# Altium schematic sheet LOGIC.SchDoc
size A3
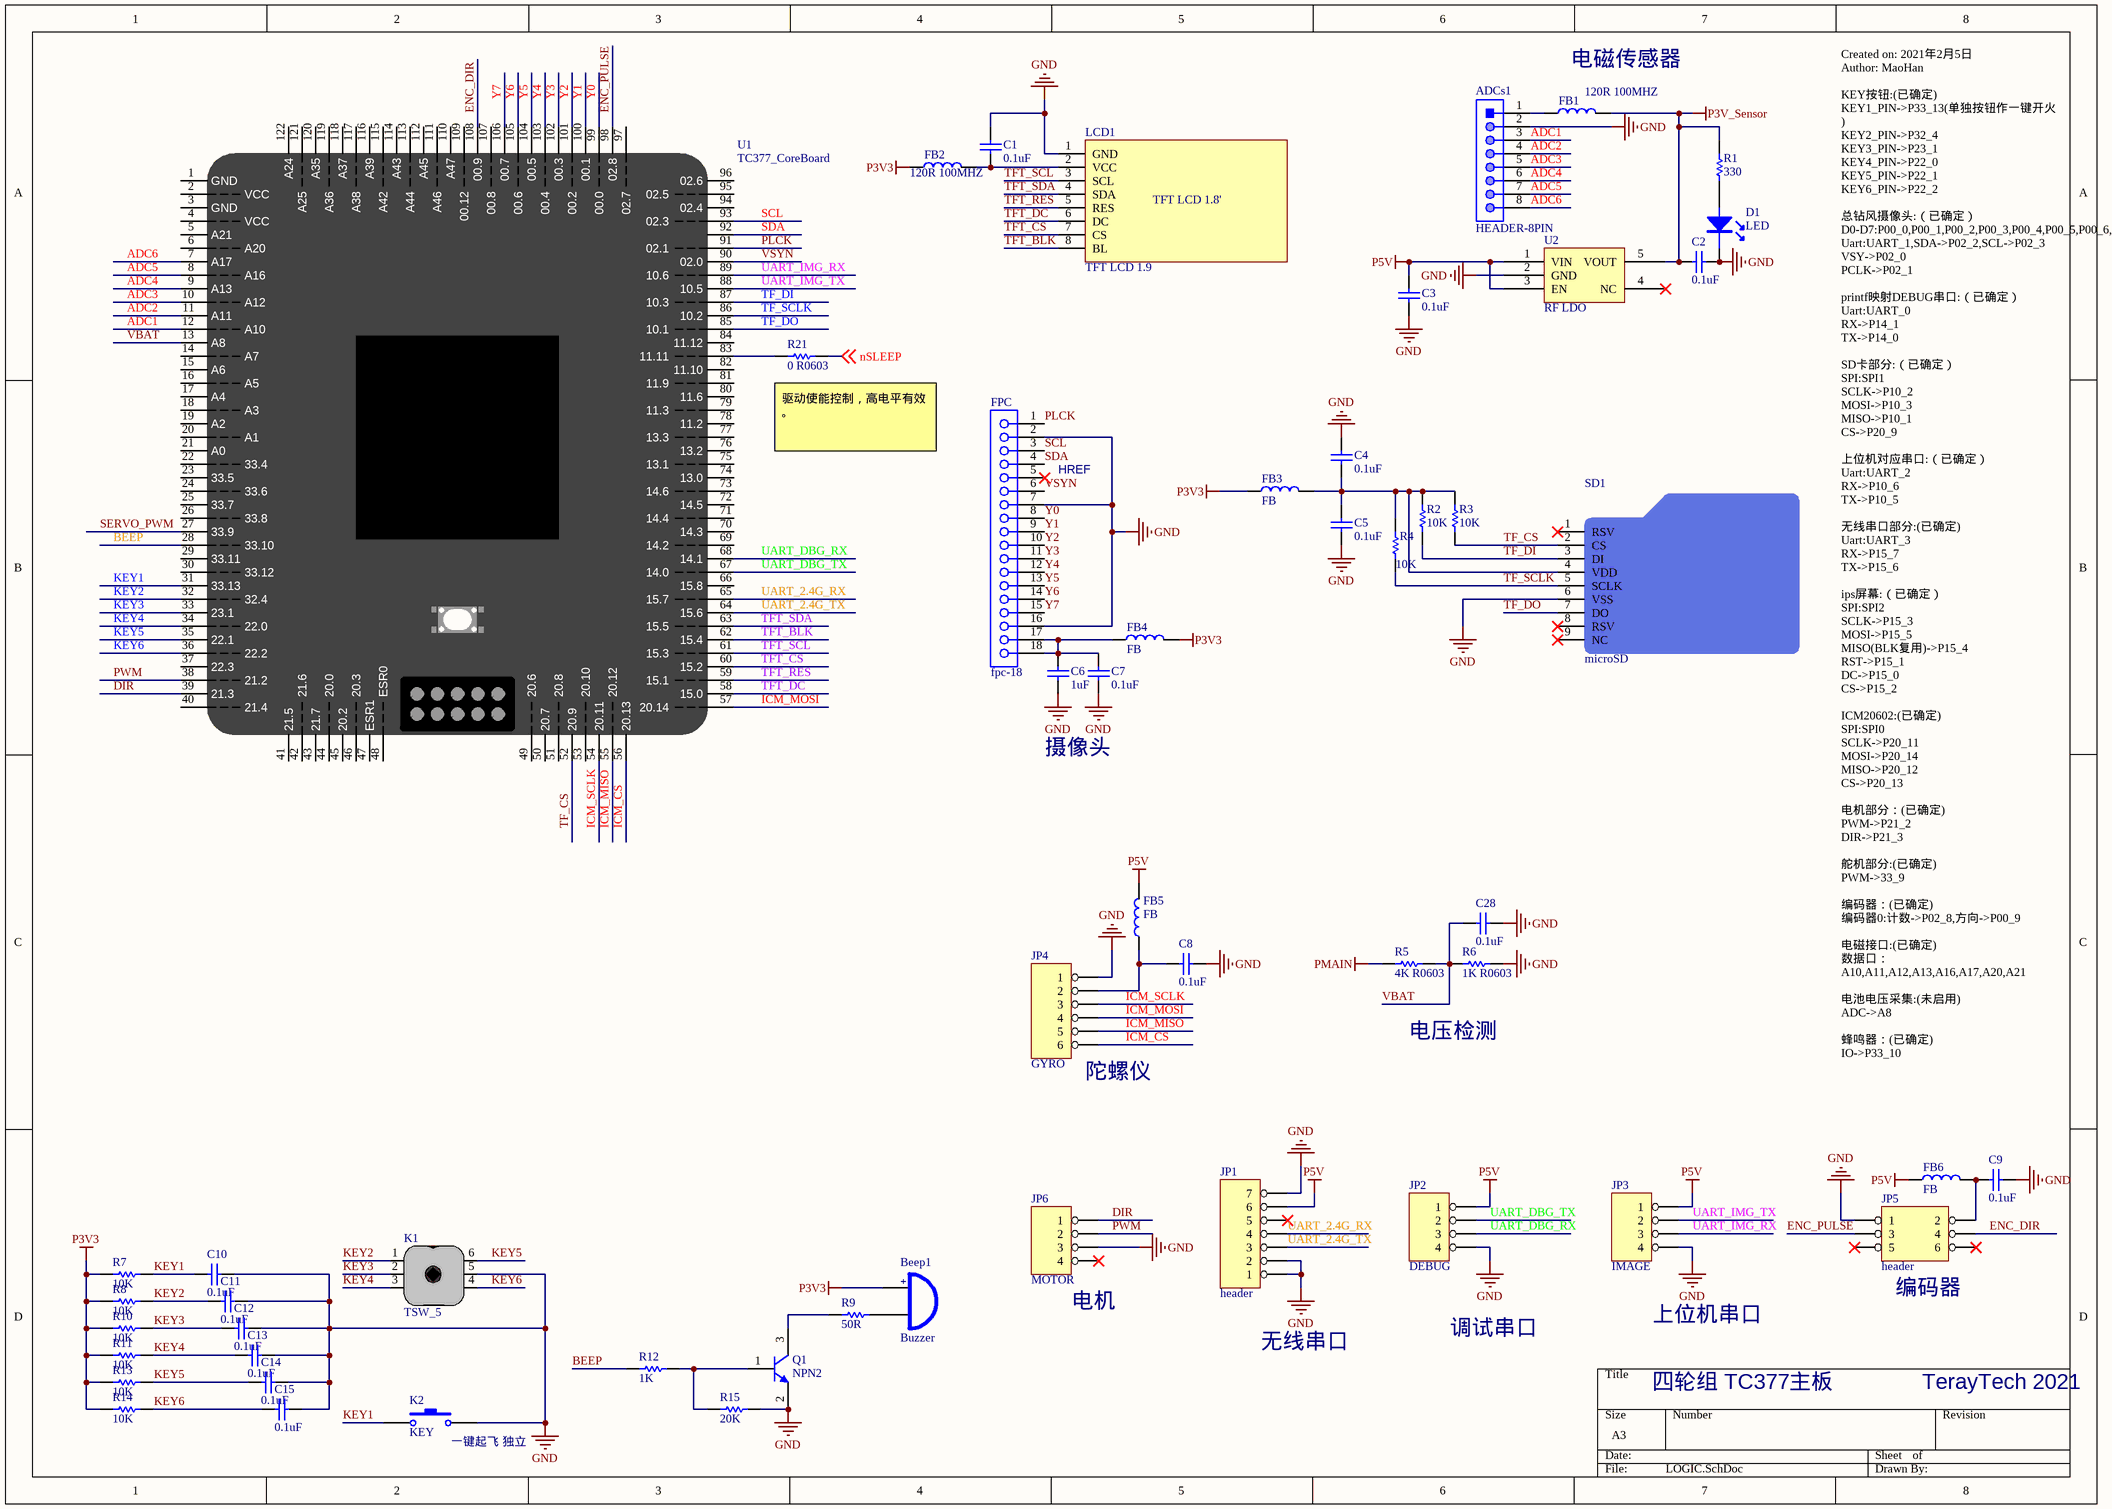
[diagram p0: LOGIC.SchDoc]

## Parts
ADCs1  HEADER-8PIN  [HEADER_8P_1.25_RT]
Beep1  Buzzer  [BUZZER_9.6*9.6*5mm]
C1  0.1uF  [0603_C]
C2  0.1uF  [0603_C]
C3  0.1uF  [0603_C]
C4  0.1uF  [0603_C]
C5  0.1uF  [0603_C]
C6  1uF  [0603_C]
C7  0.1uF  [0603_C]
C8  0.1uF  [0603_C]
C9  0.1uF  [0603_C]
C10  0.1uF  [0603_C]
C11  0.1uF  [0603_C]
C12  0.1uF  [0603_C]
C13  0.1uF  [0603_C]
C14  0.1uF  [0603_C]
C15  0.1uF  [0603_C]
C28  0.1uF  [0603_C]
D1  LED  [0603_LED]
FB1  120R 100MHZ  [FB0603]
FB2  120R 100MHZ  [FB0603]
FB3  FB  [FB0603]
FB4  FB  [FB0603]
FB5  FB  [FB0603]
FB6  FB  [FB0603]
FPC  fpc-18  [FPC_18_VER]
JP1  header  [header7]
JP2  DEBUG  [header4]
JP3  IMAGE  [header4]
JP4  GYRO  [MX 1.25-WS-6P]
JP5  header  [header2X3]
JP6  MOTOR  [MX 1.25-WS-4P]
K1  TSW_5  [TSW-10]
K2  KEY  [贴片复位开关]
LCD1  TFT LCD 1.9  [header8]
Q1  NPN2  [SOT-23-3]
R1  330  [0603_R]
R2  10K  [0603_R]
R3  10K  [0603_R]
R4  10K  [0603_R]
R5  4K R0603  [0603_R]
R6  1K R0603  [0603_R]
R7  10K  [0603_R]
R8  10K  [0603_R]
R9  50R  [0603_R]
R10  10K  [0603_R]
R11  10K  [0603_R]
R12  1K  [0603_R]
R13  10K  [0603_R]
R14  10K  [0603_R]
R15  20K  [0603_R]
R21  0 R0603  [0603_R]
SD1  microSD  [microSD_CARD]
U1  TC377_CoreBoard  [TC377_CoreBoard]
U2  RF LDO  [SOT-23-5]

## Nets
GND: ADCs1.2 C1.2 C2.1 C3.2 C4.1 C5.1 C6.2 C7.2 C8.1 C9.2 C10.2 C11.2 C12.2 C13.2 C14.2 C15.2 C28.1 D1.2(K) FPC.2 FPC.7 FPC.16 JP1.1 JP1.2 JP1.7 JP2.4 JP3.4 JP4.1 JP5.1 JP6.3 K1.5 K2.2 LCD1.1(GND) Q1.2(E) R6.2 R15.2 SD1.6(VSS) U2.2(GND)
P3V3: Beep1.1(A) FB2.1 FB3.1 FB4.2 R7.1 R8.1 R10.1 R11.1 R13.1 R14.1
P3V_Sensor: C2.2 FB1.2 R1.2 U2.5(VOUT)
P5V: C3.1 FB5.2 FB6.1 JP1.6 JP2.1 JP3.1 U2.1(VIN) U2.3(EN)
PMAIN: R5.1
ADC1: ADCs1.3 U1.12(A10)
ADC2: ADCs1.4 U1.11(A11)
ADC3: ADCs1.5 U1.10(A12)
ADC4: ADCs1.6 U1.9(A13)
ADC5: ADCs1.7 U1.8(A16)
ADC6: ADCs1.8 U1.7(A17)
BEEP: R12.1 U1.28(33.10)
DIR: JP6.1 U1.39(21.3)
ENC_DIR: JP5.4 U1.108(00.9)
ENC_PULSE: JP5.3 U1.98(02.8)
ICM_CS: JP4.6 U1.56(20.13)
ICM_MISO: JP4.5 U1.55(20.12)
ICM_MOSI: JP4.4 U1.57(20.14)
ICM_SCLK: JP4.3 U1.54(20.11)
KEY1: C10.1 K2.1 R7.2 U1.31(33.13)
KEY2: C11.1 K1.1 R8.2 U1.32(32.4)
KEY3: C12.1 K1.2 R10.2 U1.33(23.1)
KEY4: C13.1 K1.3 R11.2 U1.34(22.0)
KEY5: C14.1 K1.6 R13.2 U1.35(22.1)
KEY6: C15.1 K1.4 R14.2 U1.36(22.2)
nSLEEP: R21.2 ; off-sheet nSLEEP
PLCK: FPC.1 U1.91(02.1)
PWM: JP6.2 U1.38(21.2)
SCL: FPC.3 U1.93(02.3)
SDA: FPC.4 U1.92
SERVO_PWM: U1.27(33.9)
TF_CS: R3.1 SD1.2(CS) U1.52(20.9)
TF_DI: R2.1 SD1.3(DI) U1.87(10.3)
TF_DO: SD1.7(DO) U1.85(10.1)
TF_SCLK: R4.1 SD1.5(SCLK) U1.86(10.2)
TFT_BLK: LCD1.8(BL) U1.62(15.4)
TFT_CS: LCD1.7(CS) U1.60(15.2)
TFT_DC: LCD1.6(DC) U1.58(15.0)
TFT_RES: LCD1.5(RES) U1.59(15.1)
TFT_SCL: LCD1.3(SCL) U1.61(15.3)
TFT_SDA: LCD1.4(SDA) U1.63(15.5)
UART_2.4G_RX: JP1.4 U1.65(15.7)
UART_2.4G_TX: JP1.3 U1.64(15.6)
UART_DBG_RX: JP2.3 U1.68(14.1)
UART_DBG_TX: JP2.2 U1.67(14.0)
UART_IMG_RX: JP3.3 U1.89(10.6)
UART_IMG_TX: JP3.2 U1.88(10.5)
VBAT: C28.2 R5.2 R6.1 U1.13(A8)
VSYN: FPC.6 U1.90(02.0)
Y0: FPC.8 U1.99(00.0)
Y1: FPC.9 U1.100(00.1)
Y2: FPC.10 U1.101(00.2)
Y3: FPC.11 U1.102(00.3)
Y4: FPC.12 U1.103(00.4)
Y5: FPC.13 U1.104(00.5)
Y6: FPC.14 U1.105(00.6)
Y7: FPC.15 U1.106(00.7)
NetADCs1_1: ADCs1.1 FB1.1
NetBeep1_2: Beep1.2(B) R9.2
NetC1_1: C1.1 FB2.2 LCD1.2(VCC)
NetC4_2: C4.2 C5.2 FB3.2 R2.2 R3.2 R4.2 SD1.4(VDD)
NetC6_1: C6.1 C7.1 FB4.1 FPC.17 FPC.18
NetC8_2: C8.2 FB5.1 JP4.2
NetC9_1: C9.1 FB6.2 JP5.2
NetD1_1: D1.1(A) R1.1
NetQ1_1: Q1.1(B) R12.2 R15.1
NetQ1_3: Q1.3(C) R9.1
NetR21_1: R21.1 U1.83(11.11)

Not connected (* = marked no-connect by the designer): FPC 5*; JP1 5*; JP5 5* 6*; JP6 4*; SD1 1(RSV)* 8(RSV)* 9(NC)*; U1 1(GND) 2(VCC) 3(GND) 4(VCC) 5(A21) 6(A20) 14(A7) 15(A6) 16(A5) 17(A4) 18(A3) 19(A2) 20(A1) 21(A0) 22(33.4) 23(33.5) 24(33.6) 25(33.7) 26(33.8) 29(33.11) 30(33.12) 37(22.3) 40(21.4) 41(21.5) 42(21.6) 43(21.7) 44(20.0) 45(20.2) 46(20.3) 47(ESR1) 48(ESR0) 49(20.6) 50(20.7) 51(20.8) 53(20.10) 66(15.8) 69(14.2) 70(14.3) 71(14.4) 72(14.5) 73(14.6) 74(13.0) 75(13.1) 76(13.2) 77(13.3) 78(11.2) 79(11.3) 80(11.6) 81(11.9) 82(11.10) 84(11.12) 94(02.4) 95(02.5) 96(02.6) 97(02.7) 107(00.8) 109(00.12) 110(A47) 111(A46) 112(A45) 113(A44) 114(A43) 115(A42) 116(A39) 117(A38) 118(A37) 119(A36) 120(A35) 121(A25) 122(A24); U2 4(NC)*

## Notes on the sheet
- (near FB1) 电磁传感器
- (near R21) 驱动使能控制，高电平有效。
- (near FPC) HREF
- 摄像头
- 电压检测
- (near JP4) 陀螺仪
- Created on: 2021年2月5日
  Author: MaoHan
  KEY按钮:(已确定)
  KEY1_PIN->P33_13(单独按钮作一键开火)
  KEY2_PIN->P32_4
  KEY3_PIN->P23_1
  KEY4_PIN->P22_0
  KEY5_PIN->P22_1
  KEY6_PIN->P22_2
  总钻风摄像头:（已确定）
  D0-D7:P00_0,P00_1,P00_2,P00_3,P00_4,P00_5,P00_6,P00_7
  Uart:UART_1,SDA->P02_2,SCL->P02_3
  VSY->P02_0
  PCLK->P02_1
  printf映射DEBUG串口:（已确定）
  Uart:UART_0
  RX->P14_1
  TX->P14_0
  SD卡部分:（已确定）
  SPI:SPI1
  SCLK->P10_2
  MOSI->P10_3
  MISO->P10_1
  CS->P20_9
  上位机对应串口:（已确定）
  Uart:UART_2
  RX->P10_6
  TX->P10_5
  无线串口部分:(已确定)
  Uart:UART_3
  RX->P15_7
  TX->P15_6
  ips屏幕:（已确定）
  SPI:SPI2
  SCLK->P15_3
  MOSI->P15_5
  MISO(BLK复用)->P15_4
  RST->P15_1
  DC->P15_0
  CS->P15_2
  ICM20602:(已确定)
  SPI:SPI0
  SCLK->P20_11
  MOSI->P20_14
  MISO->P20_12
  CS->P20_13
  电机部分：(已确定)
  PWM->P21_2
  DIR->P21_3
  舵机部分:(已确定)
  PWM->33_9
  编码器：(已确定)
  编码器0:计数->P02_8,方向->P00_9
  电磁接口:(已确定)
  数据口：A10,A11,A12,A13,A16,A17,A20,A21
  电池电压采集:(未启用)
  ADC->A8
  蜂鸣器：(已确定)
  IO->P33_10
- (near JP6) 电机
- 上位机串口
- (near JP5) 编码器
- 无线串口
- 调试串口
- 四轮组 TC377主板
- TerayTech 2021
- (near K2) 一键起飞 独立
- (in symbol Buzzer) +
- (in symbol TFT LCD 1.9) TFT LCD 1.8'

## Library data of the parts
C1-C15 C28 = CAP: Capacitor; Value: 104; Published: 8-Jun-2000; LatestRevisionDate: 17-Jul-2002; LatestRevisionNote: Re-released for DXP Platform.; PackageReference: RAD-0.3; Publisher: Altium Limited
D1 = LED: LED 发光二极管
FB1 FB2 = FB: 120OHM@100MHZ 2A 25% 0603
FB3-FB6 = FB: 磁珠
JP1 = HEADER 7
JP2 JP3 JP6 = HEADER 4
JP4 = HEADER 6
JP5 = HEADER 3X2
K1 = TSW_5: 方向开关
K2 = KEY_2: Switch; Published: 24-Mar-1999; LatestRevisionDate: 17-Jul-2002; LatestRevisionNote: Re-released for DXP Platform.; PackageReference: SPST-2; Publisher: Altium Limited
Q1 = NPN2: 贴片
R1 R7 R8 R10 R11 R13 R14 = RES0: Resistor; Value: 1K; Published: 8-Jun-2000; Revision: July-2002: Re-released for DXP Platform.; Publisher: Altium Limited
R2-R5 R9 R15 R21 = RES: Resistor; Value: 1K; Published: 8-Jun-2000; Revision: July-2002: Re-released for DXP Platform.; Publisher: Altium Limited
R6 R12 = RES: Resistor; Published: 8-Jun-2000; Revision: July-2002: Re-released for DXP Platform.; Publisher: Altium Limited; Value: 1K
SD1 = microSD_1
U1 = TC377_CoreBoard: 逐飞科技TC377核心板
U2 = ADP150